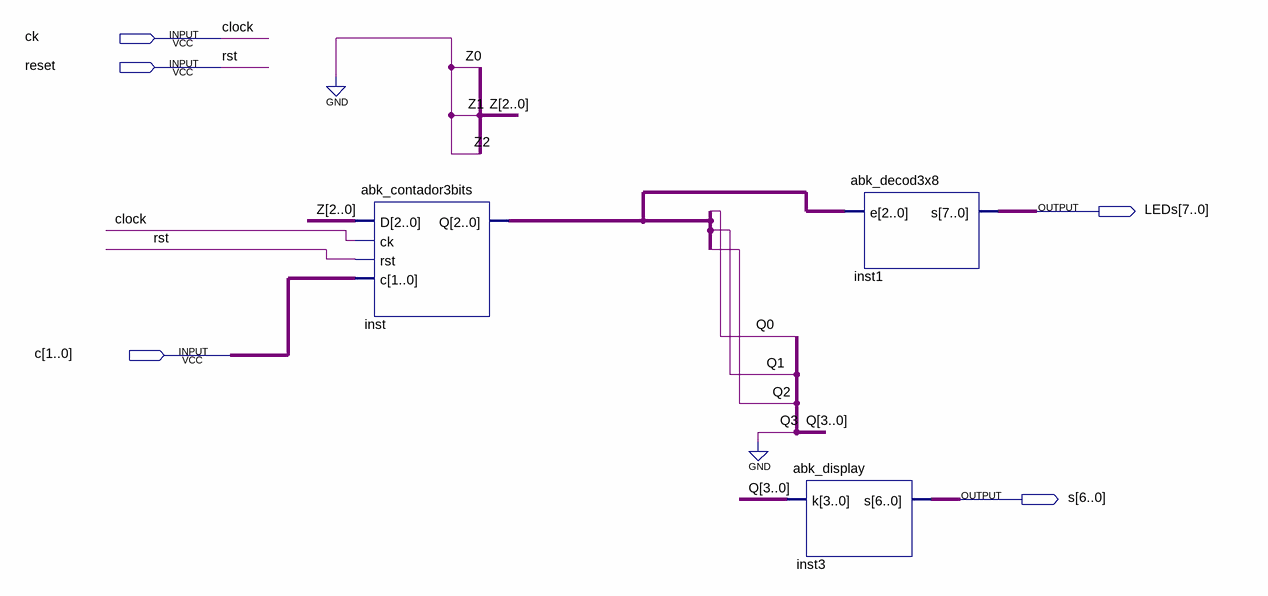
[diagram p0: schematic sheet]
// Quartus schematic abk_prova.bdf as structural Verilog: 3 symbols, 5 pins
module abk_prova (
  input  ck,
  input  reset,
  input  [1:0] c,
  output [7:0] LEDs,
  output [6:0] s
);

  wire [2:0] inst_q, Q;

  abk_contador3bits inst (.D(3'b000), .ck(ck), .rst(reset), .c(c), .Q(inst_q));
  abk_display inst3 (.k({1'b0, Q}), .s(s));
  abk_decod3x8 inst1 (.e(inst_q), .s(LEDs));

  // Other names for the same wires on the sheet: clock = ck; rst = reset
endmodule
